# Altium schematic sheet DC-Motor-DRV.SchDoc
size Tabloid
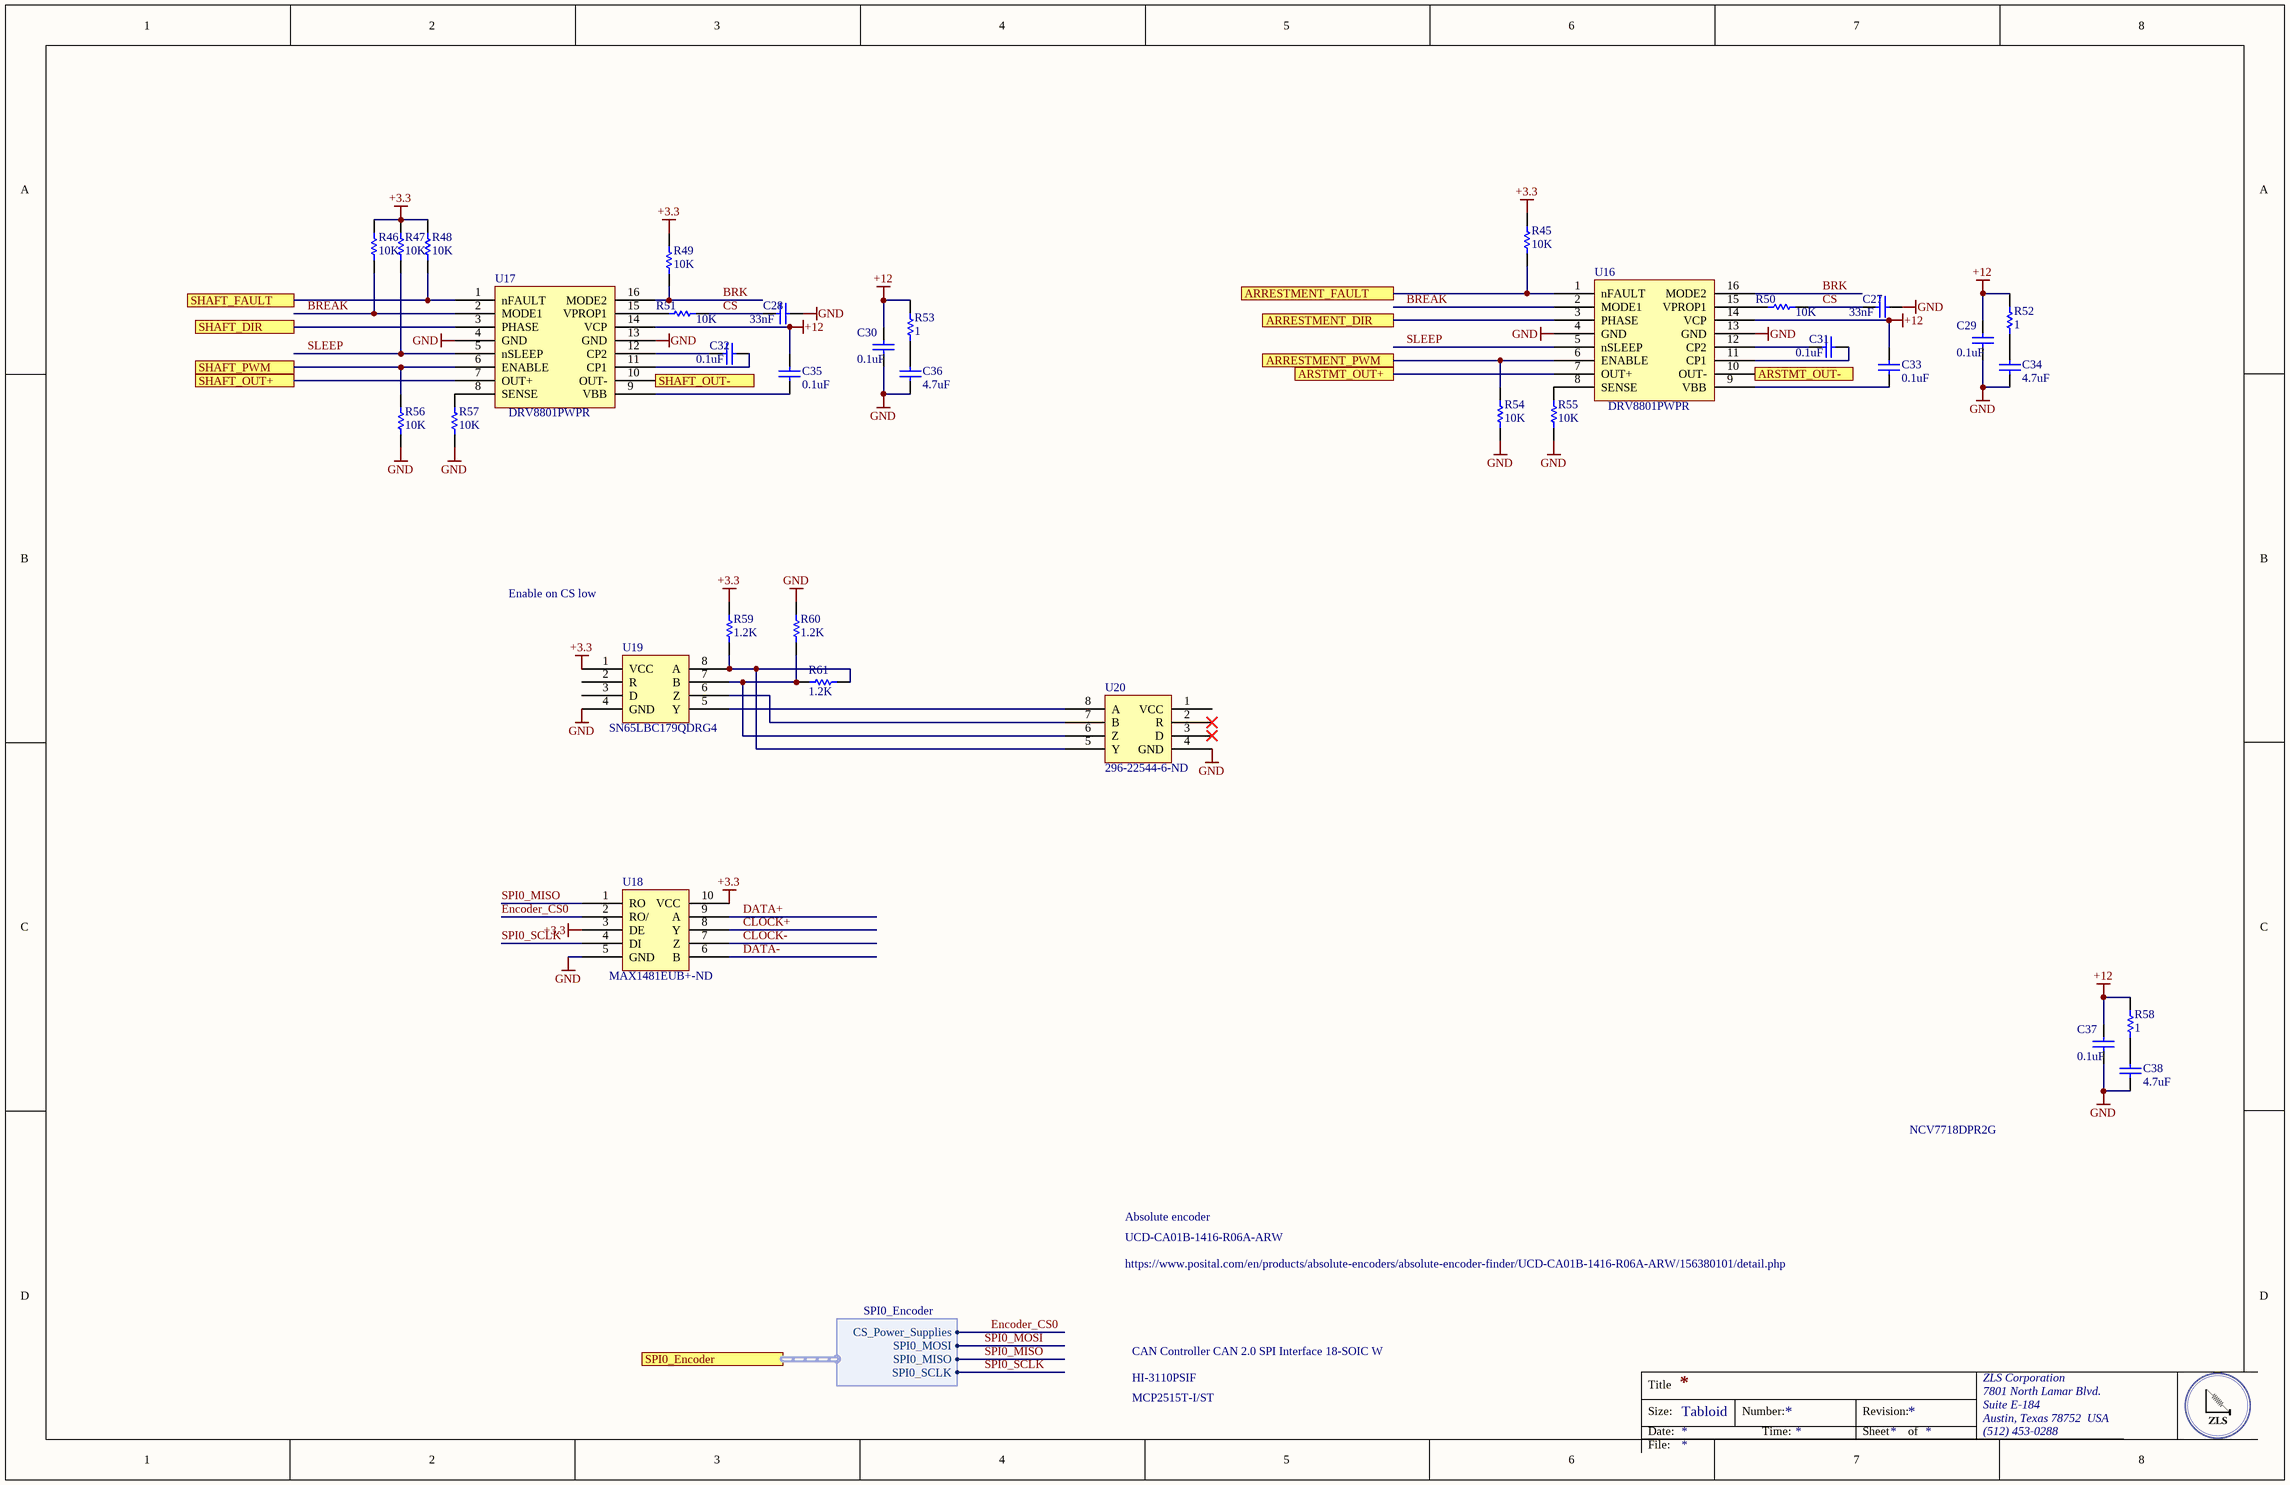
[diagram p0: DC-Motor-DRV.SchDoc]

## Parts
C27  33nF  [CAPC0402(1005)60_L]
C28  33nF  [CAPC0402(1005)60_L]
C29  0.1uF  [CAPC0402(1005)60_L]
C30  0.1uF  [CAPC0402(1005)60_L]
C31  0.1uF  [CAPC0402(1005)60_L]
C32  0.1uF  [CAPC0402(1005)60_L]
C33  0.1uF  [CAPC0402(1005)60_L]
C34  4.7uF  [CAPC0402(1005)60_L]
C35  0.1uF  [CAPC0402(1005)60_L]
C36  4.7uF  [CAPC0402(1005)60_L]
C37  0.1uF  [CAPC0402(1005)60_L]
C38  4.7uF  [CAPC0402(1005)60_L]
R45  10K  [RESC0402(1005)_M]
R46  10K  [RESC0402(1005)_M]
R47  10K  [RESC0402(1005)_M]
R48  10K  [RESC0402(1005)_M]
R49  10K  [RESC0402(1005)_M]
R50  10K  [RESC0402(1005)_M]
R51  10K  [RESC0402(1005)_M]
R52  1  [RESC0402(1005)_M]
R53  1  [RESC0402(1005)_M]
R54  10K  [RESC0402(1005)_M]
R55  10K  [RESC0402(1005)_M]
R56  10K  [RESC0402(1005)_M]
R57  10K  [RESC0402(1005)_M]
R58  1  [RESC0402(1005)_M]
R59  1.2K  [RESC0402(1005)_M]
R60  1.2K  [RESC0402(1005)_M]
R61  1.2K  [RESC0402(1005)_M]
U16  DRV8801PWPR  [DRV8801PWPR]
U17  DRV8801PWPR  [DRV8801PWPR]
U18  Supplier Part Number 1: MAX1481EUB+-ND  [MAX1486EUB+]  (hidden comment: MAX1481EUB+)
U19  SN65LBC179QDRG4  [SN65LBC179QDRG4]
U20  Supplier Part Number 1: 296-22544-6-ND  [SN65LBC179QDRG4]  (hidden comment: SN65LBC179QDRG4)

## Ports
ARRESTMENT_DIR, ARRESTMENT_FAULT, ARRESTMENT_PWM, ARSTMT_OUT+, ARSTMT_OUT-, SHAFT_DIR, SHAFT_FAULT, SHAFT_OUT+, SHAFT_OUT-, SHAFT_PWM, SPI0_Encoder (harness SPI0_Encoder)

## Harnesses
SPI0_Encoder: CS_Power_Supplies, SPI0_MOSI, SPI0_MISO, SPI0_SCLK

## Nets
+3.3: R45.2 R46.2 R47.2 R48.2 R49.2 R59.2 U18.3(DE) U18.10(VCC) U19.1(VCC)
+12: C29.2 C30.2 C33.2 C35.2 C37.2 R52.2 R53.2 R58.2 U16.14(VCP) U17.14(VCP)
GND: C27.2 C28.2 C29.1 C30.1 C34.1 C36.1 C37.1 C38.1 R54.1 R55.1 R56.1 R57.1 R60.2 U16.4(GND) U16.13(GND) U17.4(GND) U17.13(GND) U18.5(GND) U19.4(GND) U20.4(GND)
ARRESTMENT_DIR: U16.3(PHASE) ; port ARRESTMENT_DIR
ARRESTMENT_FAULT: R45.1 U16.1(nFAULT) ; port ARRESTMENT_FAULT
ARRESTMENT_PWM: R54.2 U16.6(ENABLE) ; port ARRESTMENT_PWM
ARSTMT_OUT+: U16.7(OUT+) ; port ARSTMT_OUT+
ARSTMT_OUT-: U16.10(OUT-) ; port ARSTMT_OUT-
BREAK: R46.1 U16.2(MODE1) U17.2(MODE1)
BRK: R49.1 U16.16(MODE2) U17.16(MODE2)
CLOCK+: U18.8(Y)
CLOCK-: U18.7(Z)
CS: C27.1 C28.1 R50.2 R51.2
DATA+: U18.9(A)
DATA-: U18.6(B)
Encoder_CS0: U18.2(RO/) ; port SPI0_Encoder.CS_Power_Supplies
SHAFT_DIR: U17.3(PHASE) ; port SHAFT_DIR
SHAFT_FAULT: R48.1 U17.1(nFAULT) ; port SHAFT_FAULT
SHAFT_OUT+: U17.7(OUT+) ; port SHAFT_OUT+
SHAFT_OUT-: U17.10(OUT-) ; port SHAFT_OUT-
SHAFT_PWM: R56.2 U17.6(ENABLE) ; port SHAFT_PWM
SLEEP: R47.1 U16.5(nSLEEP) U17.5(nSLEEP)
SPI0_MISO: U18.1(RO) ; port SPI0_Encoder.SPI0_MISO
SPI0_MOSI: port SPI0_Encoder.SPI0_MOSI
SPI0_SCLK: U18.4(DI) ; port SPI0_Encoder.SPI0_SCLK
NetC31_1: C31.1 U16.11(CP1)
NetC31_2: C31.2 U16.12(CP2)
NetC32_1: C32.1 U17.11(CP1)
NetC32_2: C32.2 U17.12(CP2)
NetC33_1: C33.1 U16.9(VBB)
NetC34_2: C34.2 R52.1
NetC35_1: C35.1 U17.9(VBB)
NetC36_2: C36.2 R53.1
NetC38_2: C38.2 R58.1
NetR50_1: R50.1 U16.15(VPROP1)
NetR51_1: R51.1 U17.15(VPROP1)
NetR55_2: R55.2 U16.8(SENSE)
NetR57_2: R57.2 U17.8(SENSE)
NetR59_1: R59.1 R61.1 U19.8(A) U20.5(Y)
NetR60_1: R60.1 R61.2 U19.7(B) U20.6(Z)
NetU19_5: U19.5(Y) U20.8(A)
NetU19_6: U19.6(Z) U20.7(B)

Not connected (* = marked no-connect by the designer): U19 2(R) 3(D); U20 1(VCC) 2(R)* 3(D)*

## Notes on the sheet
- Enable on CS low
- NCV7718DPR2G
- Absolute encoder
- UCD-CA01B-1416-R06A-ARW
- https://www.posital.com/en/products/absolute-encoders/absolute-encoder-finder/UCD-CA01B-1416-R06A-ARW/156380101/detail.php
- CAN Controller CAN 2.0 SPI Interface 18-SOIC W
- HI-3110PSIF
- MCP2515T-I/ST
- Title
- Size:
- Date:
- Tabloid
- Number:
- Time:
- Revision:
- Sheet
- of
- ZLS Corporation
- 7801 North Lamar Blvd.
- Suite E-184
- Austin, Texas 78752  USA
- (512) 453-0288
- File:

## Library data of the parts
C27-C38 = CMP-1034-00252-1: CAP CER 0.1UF 10V X7R 0402; Manufacturer: Murata Electronics North America; Manufacturer Part Number: GRM155R71A104KA01D; Tolerance: ±10%; Supplier 1: Digi-Key; Supplier Part Number 1: 490-6321-1-ND; RoHS: RoHS Compliant; Category: Capacitors; Stock 1: 2920395; Pricing 1: 1=0.1, 10=0.014, 100=0.0063, 500=0.00446, 1000=0.00351, 2500=0.00319, 5000=0.00293 (USD); Packaging: Cut Tape (CT); Part Status: Active; Voltage - Rated: 10V; Temperature Coefficient: X7R; Operating Temperature: -55°C ~ 125°C; Features: -; Ratings: -; Applications: General Purpose; Mounting Type: Surface Mount, MLCC; Package / Case: 0402 (1005 Metric); Size / Dimension: 0.039" L x 0.020" W (1.00mm x 0.50mm); Height - Seated (Max): -; Thickness (Max): 0.022" (0.55mm); Lead Spacing: -; ComponentLink1URL: http://www.murata.com/~/media/webrenewal/support/library/catalog/products/capacitor/mlcc/c02e.ashx?la=en-us; ComponentLink1Description: http://www.murata.com/~/media/webrenewal/support/library/catalog/products/capacitor/mlcc/c02e.ashx?la=en-us
R45-R61 = CMP-1011-00651-1
U16 U17 = DRV8801PWPR: Manufacturer: Texas Instruments; Motor Type - Stepper: Bipolar; Motor Type - AC, DC: Brushed DC; Function: Driver - Fully Integrated, Control and Power Stage; Output Configuration: Half Bridge (2); Interface: Parallel; Current - Output: 2.8A; Voltage - Supply: 8 V ~ 38 V; Supplier 1: Digi-Key; Supplier Part Number 1: 296-25378-1-ND; Manufacturer Part Number: DRV8801PWPR; RoHS: RoHS Compliant; Category: Integrated Circuits (ICs); Stock 1: 40424; Pricing 1: 1=2.37, 10=2.126, 100=1.709, 500=1.40414, 1000=1.16344 (USD); Packaging: Cut Tape (CT); Part Status: Active; Technology: DMOS; Step Resolution: -; Applications: General Purpose; Voltage - Load: 8 V ~ 38 V; Operating Temperature: -40°C ~ 150°C (TJ); Mounting Type: Surface Mount; Package / Case: 16-TSSOP (0.173", 4.40mm Width) Exposed Pad; Supplier Device Package: 16-HTSSOP; Base Part Number: DRV8801; ComponentLink1URL: http://www.ti.com/lit/ds/symlink/drv8801.pdf; ComponentLink1Description: http://www.ti.com/lit/ds/symlink/drv8801.pdf
U18 = MAX1481EUB+: Manufacturer: Maxim Integrated; Protocol: RS422, RS485; Number of Drivers/Receivers: 1/1; Duplex: Full; Data Rate: 250kbps; Voltage - Supply: 4.75 V ~ 5.25 V; Supplier 1: Digi-Key; Manufacturer Part Number: MAX1481EUB+; RoHS: RoHS Compliant; Category: Integrated Circuits (ICs); Stock 1: 308; Pricing 1: 1=2.57, 10=2.442, 25=2.28 (USD); Packaging: Tube; Part Status: Active; Type: Transceiver; Operating Temperature: -40°C ~ 85°C; Mounting Type: Surface Mount; Package / Case: 10-TFSOP, 10-MSOP (0.118", 3.00mm Width); Supplier Device Package: 10-uMAX; Base Part Number: MAX1481; ComponentLink1URL: https://datasheets.maximintegrated.com/en/ds/MAX1481-MAX1486.pdf; ComponentLink1Description: https://datasheets.maximintegrated.com/en/ds/MAX1481-MAX1486.pdf
U19 U20 = SN65LBC179QDRG4: Manufacturer: Texas Instruments; Protocol: RS422, RS485; Number of Drivers/Receivers: 1/1; Duplex: Full; Voltage - Supply: 4.75 V ~ 5.25 V; Supplier 1: Digi-Key; Manufacturer Part Number: SN65LBC179QDRG4; RoHS: RoHS Compliant; Category: Integrated Circuits (ICs); Stock 1: 4792; Pricing 1: 1=2.73, 10=2.451, 100=2.0085, 500=1.7098, 1000=1.442 (USD); Packaging: Digi-Reel®; Part Status: Active; Type: Transceiver; Data Rate: -; Operating Temperature: -40°C ~ 125°C; Mounting Type: Surface Mount; Package / Case: 8-SOIC (0.154", 3.90mm Width); Supplier Device Package: 8-SOIC; Base Part Number: SN65LBC179; ComponentLink1URL: http://www.ti.com/lit/ds/symlink/sn75lbc179.pdf; ComponentLink1Description: http://www.ti.com/lit/ds/symlink/sn75lbc179.pdf
  U19: Supplier Part Number 1: 296-22544-6-ND